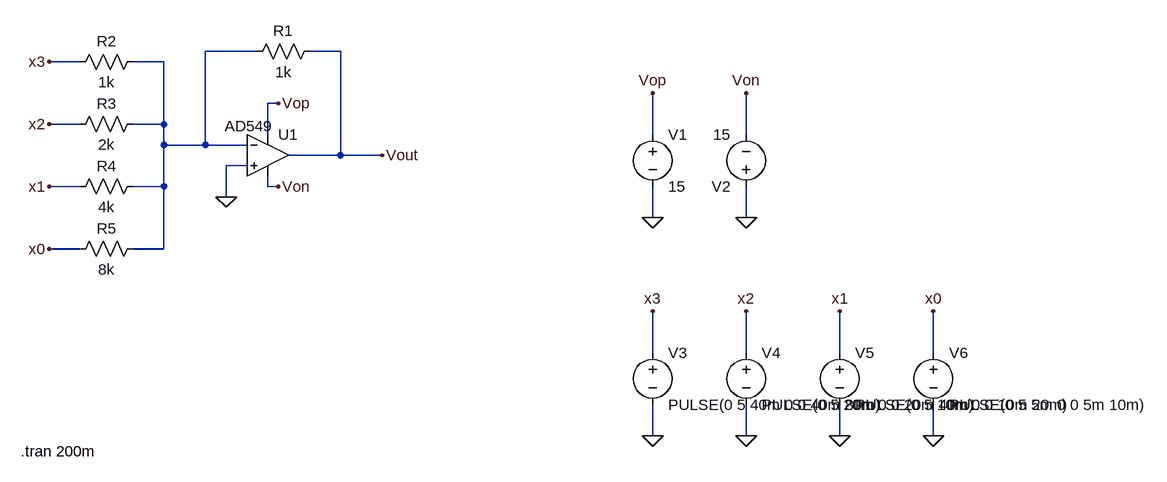
[diagram p0: schematic DAC.asc]
DAC.asc, the LTspice schematic file:
Version 4
SHEET 1 1148 680
WIRE -240 -128 -320 -128
WIRE -112 -128 -160 -128
WIRE -512 -112 -560 -112
WIRE -384 -112 -432 -112
WIRE -208 -48 -224 -48
WIRE -512 -16 -560 -16
WIRE -384 -16 -384 -112
WIRE -384 -16 -432 -16
WIRE -224 0 -224 -48
WIRE 368 0 368 -64
WIRE 512 0 512 -64
WIRE -384 16 -384 -16
WIRE -320 16 -320 -128
WIRE -320 16 -384 16
WIRE -256 16 -320 16
WIRE -112 32 -112 -128
WIRE -112 32 -192 32
WIRE -48 32 -112 32
WIRE -256 48 -288 48
WIRE -512 80 -560 80
WIRE -384 80 -384 16
WIRE -384 80 -432 80
WIRE -224 80 -224 64
WIRE -208 80 -224 80
WIRE -288 96 -288 48
WIRE 368 128 368 80
WIRE 512 128 512 80
WIRE -512 176 -560 176
WIRE -384 176 -384 80
WIRE -384 176 -432 176
WIRE 368 336 368 272
WIRE 512 336 512 272
WIRE 656 336 656 272
WIRE 800 336 800 272
WIRE 368 464 368 416
WIRE 512 464 512 416
WIRE 656 464 656 416
WIRE 800 464 800 416
FLAG 368 128 0
FLAG 368 -64 Vop
FLAG 512 128 0
FLAG 512 -64 Von
FLAG -208 -48 Vop
FLAG -208 80 Von
FLAG -288 96 0
FLAG -560 -112 x3
FLAG -560 -16 x2
FLAG -560 80 x1
FLAG -560 176 x0
FLAG -48 32 Vout
FLAG 368 464 0
FLAG 512 464 0
FLAG 656 464 0
FLAG 800 464 0
FLAG 368 272 x3
FLAG 512 272 x2
FLAG 656 272 x1
FLAG 800 272 x0
SYMBOL voltage 368 -16 R0
WINDOW 123 0 0 Left 0
WINDOW 39 0 0 Left 0
SYMATTR InstName V1
SYMATTR Value 15
SYMBOL voltage 512 96 R180
WINDOW 123 0 0 Left 0
WINDOW 39 0 0 Left 0
SYMATTR InstName V2
SYMATTR Value 15
SYMBOL OpAmps\\AD549 -224 -32 R0
WINDOW 3 -66 19 Left 2
SYMATTR InstName U1
SYMBOL res -144 -144 R90
WINDOW 0 0 56 VBottom 2
WINDOW 3 32 56 VTop 2
SYMATTR InstName R1
SYMATTR Value 1k
SYMBOL res -416 -128 R90
WINDOW 0 0 56 VBottom 2
WINDOW 3 32 56 VTop 2
SYMATTR InstName R2
SYMATTR Value 1k
SYMBOL res -416 -32 R90
WINDOW 0 0 56 VBottom 2
WINDOW 3 32 56 VTop 2
SYMATTR InstName R3
SYMATTR Value 2k
SYMBOL res -416 64 R90
WINDOW 0 0 56 VBottom 2
WINDOW 3 32 56 VTop 2
SYMATTR InstName R4
SYMATTR Value 4k
SYMBOL res -416 160 R90
WINDOW 0 0 56 VBottom 2
WINDOW 3 32 56 VTop 2
SYMATTR InstName R5
SYMATTR Value 8k
SYMBOL voltage 368 320 R0
WINDOW 123 0 0 Left 0
WINDOW 39 0 0 Left 0
SYMATTR InstName V3
SYMATTR Value PULSE(0 5 40m 0 0 40m 80m)
SYMBOL voltage 512 320 R0
WINDOW 123 0 0 Left 0
WINDOW 39 0 0 Left 0
SYMATTR InstName V4
SYMATTR Value PULSE(0 5 20m 0 0 20m 40m)
SYMBOL voltage 656 320 R0
WINDOW 123 0 0 Left 0
WINDOW 39 0 0 Left 0
SYMATTR InstName V5
SYMATTR Value PULSE(0 5 10m 0 0 10m 20m)
SYMBOL voltage 800 320 R0
WINDOW 123 0 0 Left 0
WINDOW 39 0 0 Left 0
SYMATTR InstName V6
SYMATTR Value PULSE(0 5 5m 0 0 5m 10m)
TEXT -604 488 Left 2 !.tran 200m

The netlist it stands for:
* DAC.asc
V1 Vop 0 15
V2 0 Von 15
XU1 0 N001 Vop Von Vout AD549  ; pins In+ In- V+ V- OUT
R1 Vout N001 1k
R2 N001 x3 1k
R3 N001 x2 2k
R4 N001 x1 4k
R5 N001 x0 8k
V3 x3 0 PULSE(0 5 40m 0 0 40m 80m)
V4 x2 0 PULSE(0 5 20m 0 0 20m 40m)
V5 x1 0 PULSE(0 5 10m 0 0 10m 20m)
V6 x0 0 PULSE(0 5 5m 0 0 5m 10m)
.tran 200m
.backanno
.end